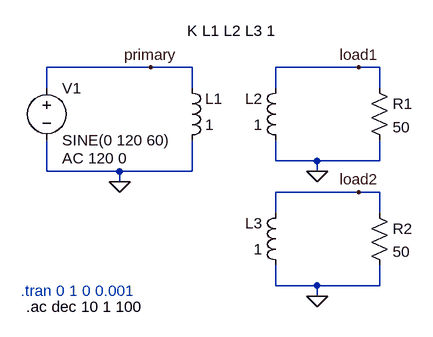
[diagram p0: schematic multiwind.asc]
multiwind.asc, the LTspice schematic file:
Version 4.1
SHEET 1 880 680
WIRE 240 64 80 64
WIRE 304 64 240 64
WIRE 560 64 432 64
WIRE 592 64 560 64
WIRE 80 96 80 64
WIRE 304 96 304 64
WIRE 432 96 432 64
WIRE 592 96 592 64
WIRE 432 208 432 176
WIRE 496 208 432 208
WIRE 592 208 592 176
WIRE 592 208 496 208
WIRE 80 224 80 176
WIRE 192 224 80 224
WIRE 304 224 304 176
WIRE 304 224 192 224
WIRE 496 224 496 208
WIRE 192 240 192 224
WIRE 560 256 432 256
WIRE 592 256 560 256
WIRE 432 288 432 256
WIRE 592 288 592 256
WIRE 432 400 432 368
WIRE 496 400 432 400
WIRE 592 400 592 368
WIRE 592 400 496 400
WIRE 496 416 496 400
FLAG 240 64 primary
FLAG 560 64 load1
FLAG 560 256 load2
FLAG 192 240 0
FLAG 496 224 0
FLAG 496 416 0
SYMBOL voltage 80 80 R0
WINDOW 123 24 124 Left 2
WINDOW 39 0 0 Left 0
SYMATTR Value2 AC 120 0
SYMATTR InstName V1
SYMATTR Value SINE(0 120 60)
SYMBOL ind 288 192 M180
WINDOW 0 36 80 Left 2
WINDOW 3 36 40 Left 2
SYMATTR InstName L1
SYMATTR Value 1
SYMATTR Type ind
SYMATTR SpiceLine Rser=1m
SYMBOL ind 448 192 R180
WINDOW 0 36 80 Left 2
WINDOW 3 36 40 Left 2
SYMATTR InstName L2
SYMATTR Value 1
SYMATTR Type ind
SYMATTR SpiceLine Rser=1m
SYMBOL ind 448 384 R180
WINDOW 0 36 80 Left 2
WINDOW 3 36 40 Left 2
SYMATTR InstName L3
SYMATTR Value 1
SYMATTR Type ind
SYMATTR SpiceLine Rser=1m
SYMBOL res 576 80 R0
SYMATTR InstName R1
SYMATTR Value 50
SYMBOL res 576 272 R0
SYMATTR InstName R2
SYMATTR Value 50
TEXT 296 8 Left 2 !K L1 L2 L3 1
TEXT 40 408 Left 2 ;.tran 0 1 0 0.001
TEXT 48 432 Left 2 !.ac dec 10 1 100

The netlist it stands for:
* multiwind.asc
V1 primary 0 SINE(0 120 60) AC 120 0
L1 0 primary 1 Rser=1m
L2 0 load1 1 Rser=1m
L3 0 load2 1 Rser=1m
R1 load1 0 50
R2 load2 0 50
K L1 L2 L3 1
* .tran 0 1 0 0.001
.ac dec 10 1 100
.backanno
.end